# Altium schematic sheet Main_Circuit.SchDoc
size A; SheetNumber: 2; SheetTotal: 2
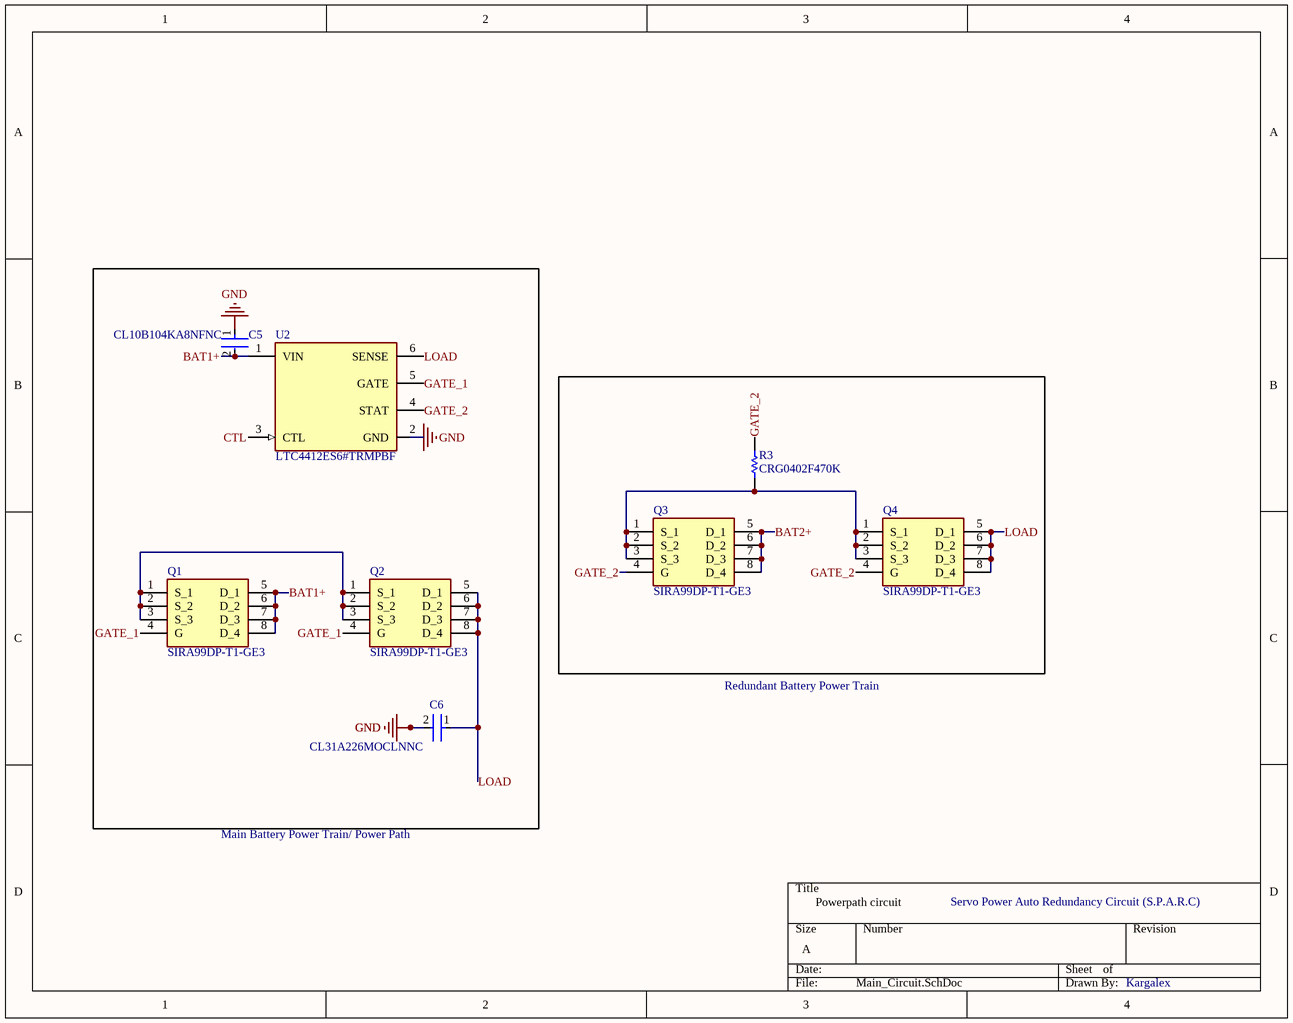
[diagram p0: Main_Circuit.SchDoc]

## Parts
C5  CL10B104KA8NFNC  [FP-CL10-IPC_C]
C6  CL31A226MOCLNNC  [FP-CL31-IPC_A]
Q1  SIRA99DP-T1-GE3  [SI7141DPT1GE3]
Q2  SIRA99DP-T1-GE3  [SI7141DPT1GE3]
Q3  SIRA99DP-T1-GE3  [SI7141DPT1GE3]
Q4  SIRA99DP-T1-GE3  [SI7141DPT1GE3]
R3  CRG0402F470K  [RESC1005X40X25LL10T10]
U2  LTC4412ES6#TRMPBF  [FP-S6-6-05-08-1636-IPC_C]

## Nets
GND: C5.1 C6.2 U2.2(GND)
BAT1+: C5.2 Q1.5(D_1) Q1.6(D_2) Q1.7(D_3) Q1.8(D_4) U2.1(VIN)
BAT2+: Q3.5(D_1) Q3.6(D_2) Q3.7(D_3) Q3.8(D_4)
CTL: U2.3(CTL)
GATE_1: Q1.4(G) Q2.4(G) U2.5(GATE)
GATE_2: Q3.4(G) Q4.4(G) R3.2 U2.4(STAT)
LOAD: C6.1 Q2.5(D_1) Q2.6(D_2) Q2.7(D_3) Q2.8(D_4) Q4.5(D_1) Q4.6(D_2) Q4.7(D_3) Q4.8(D_4) U2.6(SENSE)
NetQ1_1: Q1.1(S_1) Q1.2(S_2) Q1.3(S_3) Q2.1(S_1) Q2.2(S_2) Q2.3(S_3)
NetQ3_1: Q3.1(S_1) Q3.2(S_2) Q3.3(S_3) Q4.1(S_1) Q4.2(S_2) Q4.3(S_3) R3.1

## Notes on the sheet
- Redundant Battery Power Train
- Main Battery Power Train/ Power Path
- Powerpath circuit
- Servo Power Auto Redundancy Circuit (S.P.A.R.C)
- (near C6) @C6 value can be calculated with spice
  Simplified : C  = I*Δt(fall_time)/ΔV
- Kargalex

## Library data of the parts
C5 = CMP-13271-001423-1: Cap Ceramic 100nF 25V X7R ±10% Pad SMD 0603 +125°C T/R; Depth: 0.8mm; Tolerance: 10%; Case Code (Imperial): 0603; Max Operating Temperature: 125°C; Min Operating Temperature: -55°C; Dielectric: X7R; Width: 0.031inch; Thickness: 0.035inch; Height: 0.8mm; Length: 1.6mm; Mount: Surface Mount; Capacitance: 100nF; Voltage Rating: 25V; Case Code (Metric): 1608; Case/Package: 0603; Radiation Hardening: No; Packaging: Tape and Reel
C6 = CMP-13271-002013-1: Cap Ceramic 22uF 16V X5R ±20% SMD 1206 +85°C Embossed T/R; Height: 0.85mm; Min Operating Temperature: -55°C; Thickness: 0.037inch; Depth: 1.6mm; Length: 3.2mm; Tolerance: 20%; Case Code (Imperial): 1206; Capacitance: 22uF; Package Quantity: 1; Radiation Hardening: No; Case/Package: 1206; Dielectric: X5R; Packaging: Tape and Reel; Voltage: 16V; Case Code (Metric): 3216; Width: 0.063inch; Lead Free: Lead Free; Mount: Surface Mount; Voltage Rating: 16V; Max Operating Temperature: 85°C
Q1-Q4 = SIRA99DP-T1-GE3: MOSFET (P-Channel); Manufacturer_Name: Vishay; Datasheet Link: https://www.vishay.com/docs/71023/sira99dp.pdf; Manufacturer_Part_Number: SIRA99DP-T1-GE3; Mouser Part Number: 78-SIRA99DP-T1-GE3; Mouser Price/Stock: https://www.mouser.co.uk/ProductDetail/Vishay-Semiconductors/SIRA99DP-T1-GE3?qs=UkDUCjYnTB2B5E%2FMLQOT2A%3D%3D; Arrow Part Number: SIRA99DP-T1-GE3; Arrow Price/Stock: https://www.arrow.com/en/products/sira99dp-t1-ge3/vishay?region=nac
R3 = CMP-2002-05737-1: Manufacturer: TE Connectivity / AMP; Part Number: CRG0402F470K
U2 = CMP-0479-00425-2: IC OR CTRLR SRC SELECT TSOT23-6; Min Supply Voltage: 2.5V; Max Supply Voltage: 28V; Turn-On Delay Time: 110us; Number of Channels: 1; Lead Free: Lead Free; Length: 2.9mm; Radiation Hardening: No; RoHS Compliant: Yes; Package Quantity: 1; Min Operating Temperature: -40°C; Series: PowerPath™; Packaging: Tape and Reel; Width: 1.75mm; Height: 0.9mm; Number of Pins: 6; Max Operating Temperature: 85°C; Number of Outputs: 1; Case/Package: TSOT; REACH SVHC: No SVHC